# Altium schematic sheet 12V_to_5V_LDO_1A.SchDoc
size A; Organization: Cal Poly Racing; engineer1: who?
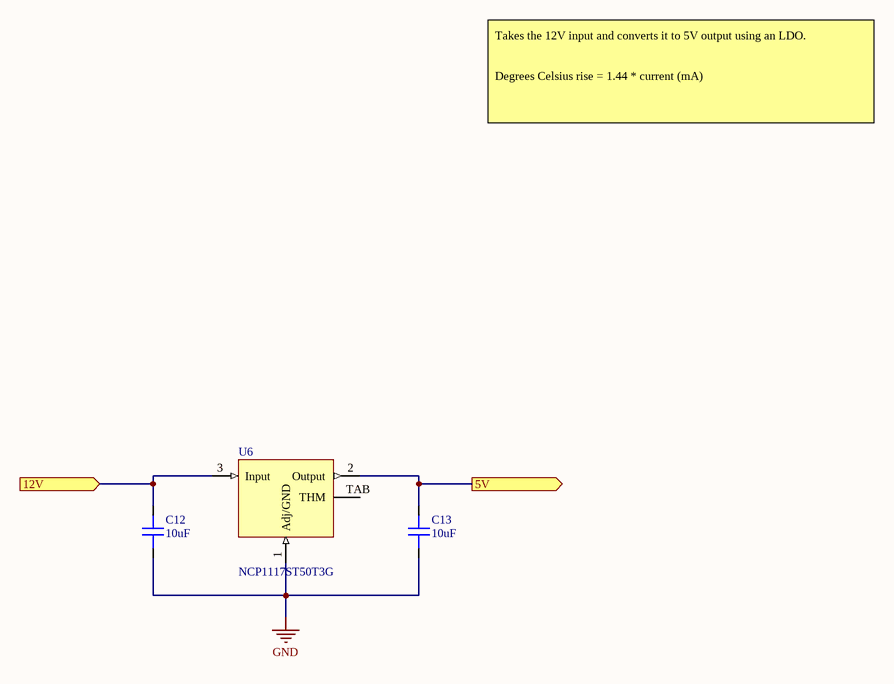
[diagram p0: 12V_to_5V_LDO_1A.SchDoc]

## Parts
C12  capacitance: 10uF  [0603]  (hidden comment: capacitor)
C13  capacitance: 10uF  [0603]  (hidden comment: capacitor)
U6  NCP1117ST50T3G  [SOT-223-3]

## Ports
5V (out), 12V (in)

## Nets
GND: C12.1 C13.1 U6.1(Adj/GND)
5V: C13.2 U6.2(Output) ; port 5V
12V: C12.2 U6.3(Input) ; port 12V

Not connected (* = marked no-connect by the designer): U6 TAB(THM)

## Notes on the sheet
- Takes the 12V input and converts it to 5V output using an LDO.
  Degrees Celsius rise = 1.44 * current (mA)
- Date:
- Time:
- File:

## Library data of the parts
C12 C13 = 1: Generic 0603 capacitor; id: 1; voltage: 50; dielectric: Ceramic; percent tolerance: 10; name: 0603 Capacitor; ESR: 1; package: 0603; quantity: 0
U6 = 16: 5V linear regulator; id: 16; imax: 1; name: NCP1117ST50T3G; package: SOT-223-3; quantity: 0; link: https://www.digikey.com/product-detail/en/on-semiconductor/NCP1117ST50T3G/NCP1117ST50T3GOSCT-ND/1967217